# EAGLE design placa_v1 (EAGLE 7.2.0)
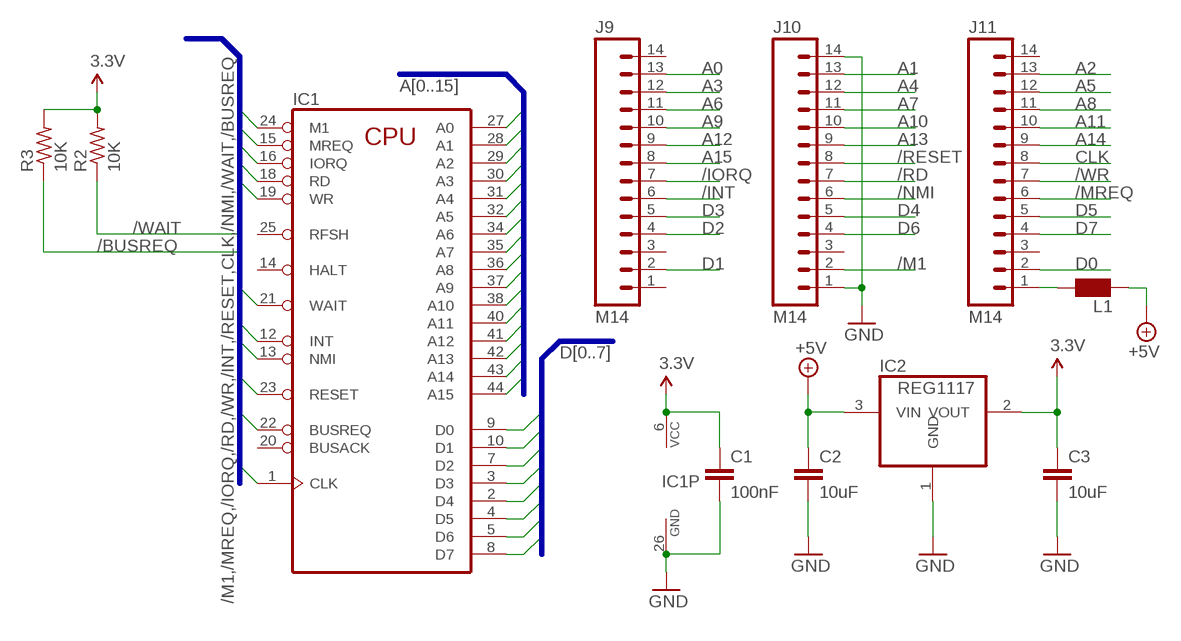
[diagram p0: schematic, sheet 1]

## Parts
C1  100nF  C-EUC0805K  [C0805K]
C2  10uF  C-EUC0805K  [C0805K]
C3  10uF  C-EUC0805K  [C0805K]
IC1  Z80CPU-F  [QFP-44]
IC2  REG1117  [SOT223]
J9  M14  [1X14]
J10  M14  [1X14]
J11  M14  [1X14]
L1  WE-CBF_0805  [0805]
R2  10K  R-US_R0805  [R0805]
R3  10K  R-US_R0805  [R0805]

## Nets
3.3V [power]: C1.1 C3.1 IC1.6(VCC) IC2.2(VOUT) R2.2 R3.2
+5V [power]: C2.1 IC2.3(VIN) L1.2
/BUSREQ: IC1.22(BUSREQ) R3.1
/INT: IC1.12(INT) J9.6
/IORQ: IC1.16(IORQ) J9.7
/M1: IC1.24(M1) J10.2
/MREQ: IC1.15(MREQ) J11.6
/NMI: IC1.13(NMI) J10.6
/RD: IC1.18(RD) J10.7
/RESET: IC1.23(RESET) J10.8
/WAIT: IC1.21(WAIT) R2.1
/WR: IC1.19(WR) J11.7
A0: IC1.27(A0) J9.13
A1: IC1.28(A1) J10.13
A2: IC1.29(A2) J11.13
A3: IC1.30(A3) J9.12
A4: IC1.31(A4) J10.12
A5: IC1.32(A5) J11.12
A6: IC1.34(A6) J9.11
A7: IC1.35(A7) J10.11
A8: IC1.36(A8) J11.11
A9: IC1.37(A9) J9.10
A10: IC1.38(A10) J10.10
A11: IC1.40(A11) J11.10
A12: IC1.41(A12) J9.9
A13: IC1.42(A13) J10.9
A14: IC1.43(A14) J11.9
A15: IC1.44(A15) J9.8
CLK: IC1.1(CLK) J11.8
D0: IC1.9(D0) J11.2
D1: IC1.10(D1) J9.2
D2: IC1.7(D2) J9.4
D3: IC1.3(D3) J9.5
D4: IC1.2(D4) J10.5
D5: IC1.4(D5) J11.5
D6: IC1.5(D6) J10.4
D7: IC1.8(D7) J11.4
GND [power]: C1.2 C2.2 C3.2 IC1.26(GND) IC2.1(GND) J10.1 J10.14
N$1 [power]: J11.1 L1.1
Unconnected: IC1.11(NC) IC1.14(HALT) IC1.17(NC) IC1.20(BUSACK) IC1.25(RFSH) IC1.33(NC) IC1.39(NC) J9.1 J9.3 J9.14 J10.3 J11.3 J11.14

## Buses
A[0..15]
D[0..7]
/M1,/MREQ,/IORQ,/RD,/WR,/INT,/RESET,CLK,/NMI,/WAIT,/BUSREQ

## Library data of the parts
C1-C3 = rcl:C-EU: CAPACITOR, European symbol
IC1 = Z80FAMIL:Z80CPU-F
IC2 = burr-brown:REG1117: 800mA and 1A Low Dropout (LDO) Positive Regulator 1.8V, 2.5V, 2.85V, 3.3V, 5V, and Adj
J9-J11 = SparkFun:M14: Header 14 Standard 14-pin 0.1" header. Use with straight break away headers (SKU : PRT-00116), right angle break away headers (PRT-00553), swiss pins (PRT-00743), machine pins (PRT-00117), and female headers (PRT-00115).
L1 = wuerth-elektronik:WE-CBF: SMD EMI Suppression Ferrite Beads - excellent anti-EMI properties - low DCR - impedances till 3000 ohms - rated current up to 6 A
R2 R3 = rcl:R-US_: RESISTOR, American symbol

## Net classes
0 default: width 0.203 mm, clearance 0.203 mm
1 power: width 0.406 mm, clearance 0.203 mm to class 0, clearance 0.203 mm

## Board
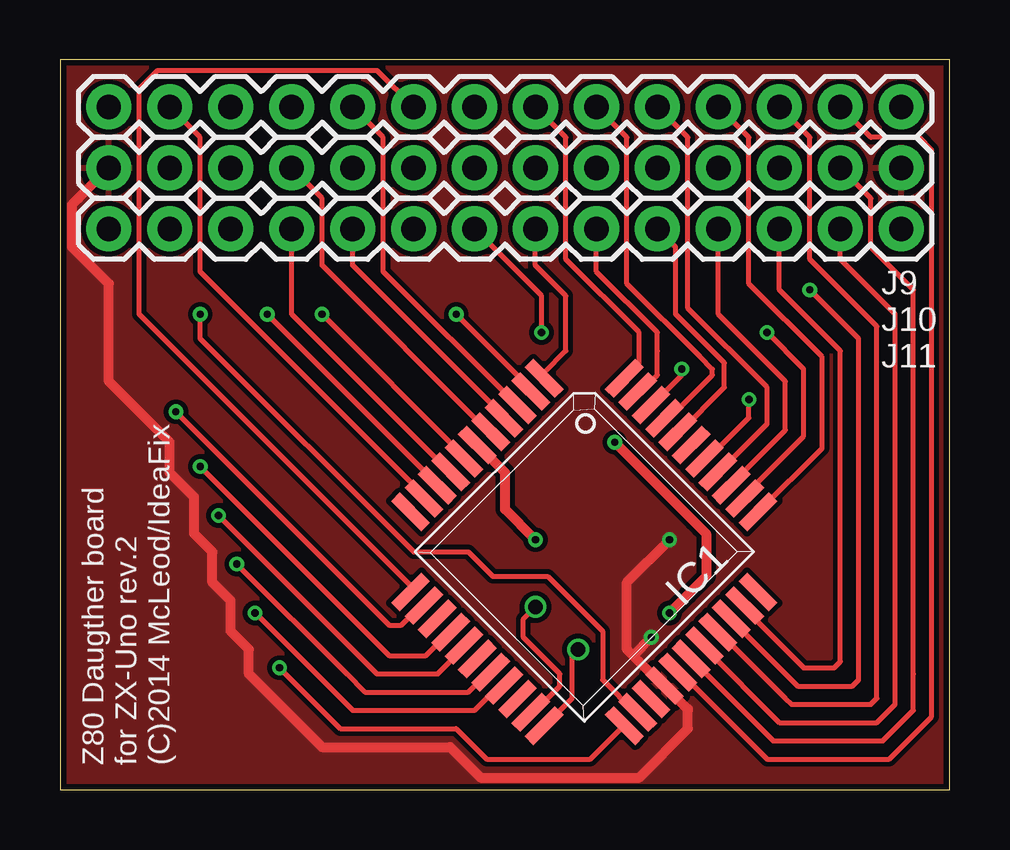
[diagram p1: board, top side]
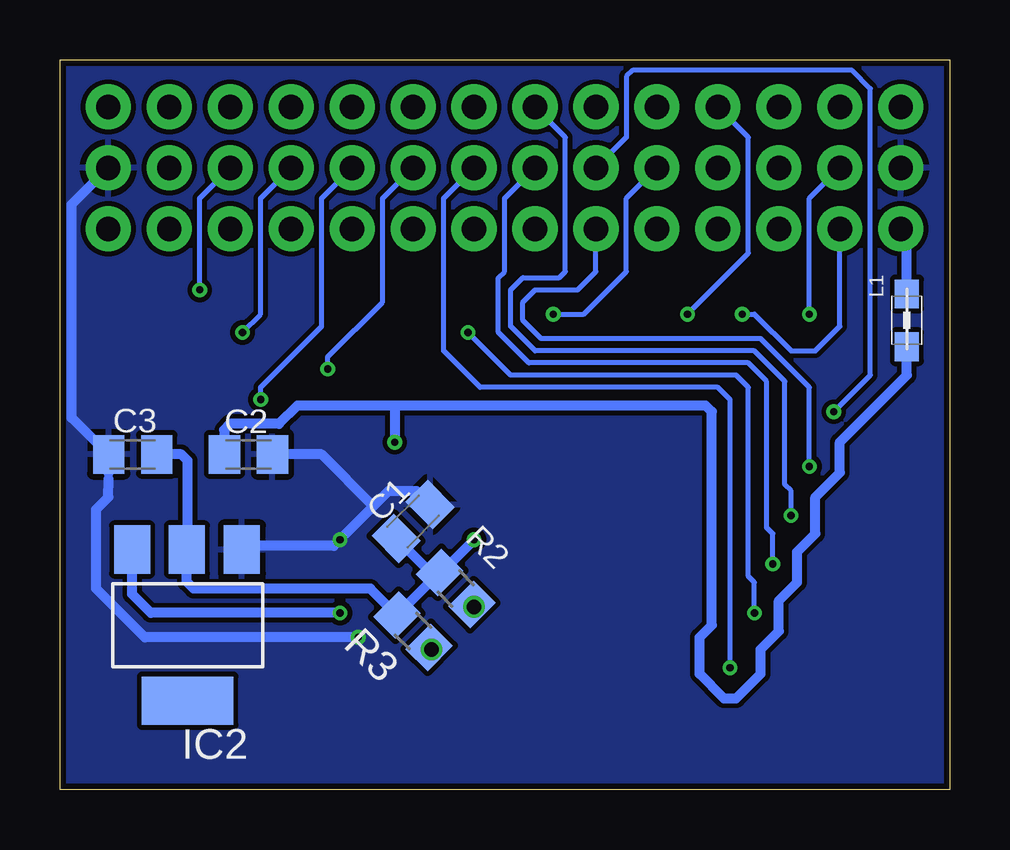
[diagram p2: board, bottom side, seen from below]

Size 37.06 x 30.4 mm. Coordinates in mm from the lower left corner, seen from the top.
Outline: 0,0 37.06,0 37.06,30.4 0,30.4 0,0
Copper layers (1*16): Top 0.035mm / dielectric 1.5mm / Bottom 0.035mm
Design rules "ITEADstudio_DRC": minimum track width 6mil, minimum drill 12mil, track to track 6mil, track to pad 6mil, pad to pad 6mil, via to via 6mil, smd to smd 0mil, copper to edge 10mil, drill to drill 10mil, minimum pad ring 10mil, minimum via ring 6mil, stop-mask expansion 2mil, vias tented up to drill 100mil, thermal gap 10mil

### Footprints (pad centres in the part's own frame; a part is rotated, then mirrored left to right if it is on the bottom)
C0805K = smd 1.3 x 1.6: 1 -1,0; 2 1,0
QFP-44 = smd 0.508 x 1.778: 1 -3.937,-6.299; 2 -3.15,-6.299; 3 -2.362,-6.299; 4 -1.575,-6.299; 5 -0.787,-6.299; 6 0,-6.299; 7 0.787,-6.299; 8 1.575,-6.299; 9 2.362,-6.299; 10 3.15,-6.299; 11 3.937,-6.299; 23 3.937,6.299; 24 3.15,6.299; 25 2.362,6.299; 26 1.575,6.299; 27 0.787,6.299; 28 0,6.299; 29 -0.787,6.299; 30 -1.575,6.299; 31 -2.362,6.299; 32 -3.15,6.299; 33 -3.937,6.299 | smd 1.778 x 0.508: 12 6.299,-3.937; 13 6.299,-3.15; 14 6.299,-2.362; 15 6.299,-1.575; 16 6.299,-0.787; 17 6.299,0; 18 6.299,0.787; 19 6.299,1.575; 20 6.299,2.362; 21 6.299,3.15; 22 6.299,3.937; 34 -6.299,3.937; 35 -6.299,3.15; 36 -6.299,2.362; 37 -6.299,1.575; 38 -6.299,0.787; 39 -6.299,0; 40 -6.299,-0.787; 41 -6.299,-1.575; 42 -6.299,-2.362; 43 -6.299,-3.15; 44 -6.299,-3.937
SOT223 = smd 1.499 x 2.007: 1 -2.261,-3.15; 2 0.025,-3.15; 3 2.311,-3.15 | smd 3.81 x 2.007: 4 0,3.15
1X14 = drill 1.016 pad 1.88: 1 0,0; 2 2.54,0; 3 5.08,0; 4 7.62,0; 5 10.16,0; 6 12.7,0; 7 15.24,0; 8 17.78,0; 9 20.32,0; 10 22.86,0; 11 25.4,0; 12 27.94,0; 13 30.48,0; 14 33.02,0
0805 = smd 1.2 x 1: 1 -1.1,0; 2 1.1,0
R0805 = smd 1.3 x 1.5: 1 -0.95,0; 2 0.95,0

### Placement (x,y rotation side)
C1  22.35,11.18 45 bottom
C2  29.21,13.97 0 bottom
C3  34.04,13.97 180 bottom
IC1  21.84,9.91 225 top
IC2  31.75,6.86 180 bottom
J9  2.03,28.45 0 top
J10  2.03,25.91 0 top
J11  2.03,23.37 0 top
L1  1.78,19.56 270 bottom
R2  20.57,8.38 135 bottom
R3  22.35,6.6 135 bottom

### Tracks (layer width: path | path; a pad name or v marks a point on that pad's centre or on a via)
3.3V  (via drill 0.3)
  Top 0.406: IC1.6 18.54,13.21 18.54,11.68 v19.81,10.41
  Bottom 0.203: 21.64,9.05 R2.2 20.9,9.4 20.83,9.4 | IC2.2 31.75,10.03
  Bottom 0.406: 21.64,9.05 C1.1 | R2.2 R3.2 24.13,8.38 31.5,8.38 31.77,8.66 IC2.2 | 20.83,9.4 v19.81,10.41 | C3.1 32,13.97 31.75,13.72 31.75,10.03
+5V  (via drill 0.3)
  Top 0.406: v25.4,7.37 26.16,8.13 26.92,8.89 26.92,10.67 26.67,10.92 26.42,11.18 v23.11,14.48
  Bottom 0.203: 30.23,13.99 C2.1
  Bottom 0.406: L1.2 1.78,17.27 4.57,14.48 4.57,13.21 5.59,12.19 5.59,10.67 6.35,9.91 6.35,8.64 7.11,7.87 7.11,6.6 7.87,5.84 7.87,4.83 8.89,3.81 9.4,3.81 10.41,4.83 10.41,6.35 9.91,6.86 9.91,15.75 10.16,16 21.59,16 23.11,16 | 23.11,16 27.18,16 27.94,15.24 29.97,15.24 30.23,14.99 30.23,13.99 | IC2.3 34.06,8.15 33.27,7.37 v25.4,7.37 | v23.11,14.48 23.11,15.49 23.11,16
/BUSREQ  (via drill 0.6)
  Top 0.203: IC1.22 20.19,2.67 21.34,3.81 21.34,5.59 v21.59,5.84
  Bottom 0.203: v21.59,5.84 21.34,5.59 R3.1
/INT
  Top 0.203: IC1.12 14.61,8.51 3.3,19.81 3.3,29.21 4.06,29.97 13.21,29.97 J9.6
/IORQ  (via drill 0.3)
  Top 0.203: IC1.16 16.83,5.91 15.75,4.83 13.21,4.83 v6.6,11.43
  Bottom 0.203: v6.6,11.43 6.6,12.45 6.86,12.7 6.86,17.02 8.13,18.29 17.27,18.29 18.29,19.3 18.29,20.83 18.03,21.08 17.78,21.34 16.26,21.34 16,21.59 16,27.18 J9.7
/M1  (via drill 0.3 pad 0.61)
  Top 0.203: IC1.24 23.95,3.23 22.61,4.57 22.61,6.6 20.32,8.89 18.03,8.89 17.02,9.91 14.73,9.91 5.84,18.8 v5.84,19.81
  Bottom 0.203: v5.84,19.81 5.84,24.64 J10.2
/MREQ  (via drill 0.3)
  Top 0.203: IC1.15 16.22,6.57 15.24,5.59 13.72,5.59 v5.84,13.46
  Bottom 0.203: v5.84,13.46 5.84,16.76 7.87,18.8 17.02,18.8 17.78,19.56 17.78,20.32 17.27,20.83 15.49,20.83 14.73,21.59 J11.6
/NMI  (via drill 0.3 pad 0.61)
  Top 0.203: IC1.13 15.04,7.68 14.22,6.86 13.72,6.86 12.95,7.62 v4.83,15.75
  Bottom 0.203: v4.83,15.75 3.3,17.27 3.3,29.21 4.06,29.97 13.21,29.97 13.46,29.72 13.46,27.18 J10.6
/RD  (via drill 0.3)
  Top 0.203: IC1.18 17.85,4.89 17.02,4.06 12.7,4.06 11.94,4.83 v7.37,9.4
  Bottom 0.203: v7.37,9.4 7.37,10.67 7.62,10.92 7.62,17.02 8.38,17.78 17.53,17.78 18.8,19.05 18.8,21.34 18.54,21.59 18.54,24.64 J10.7
/RESET  (via drill 0.3)
  Top 0.203: IC1.23 23.5,2.67 22.1,1.27 17.78,1.27 16.51,2.54 11.68,2.54 v9.14,5.08
  Bottom 0.203: v9.14,5.08 9.14,16.26 9.65,16.76 19.56,16.76 21.08,18.29 21.08,24.64 J10.8
/WAIT  (via drill 0.6)
  Top 0.203: IC1.21 19.73,3.23 20.83,4.32 20.83,4.83 19.3,6.35 19.3,7.11 v19.81,7.62
  Bottom 0.203: v19.81,7.62 19.56,7.37 R2.1
/WR  (via drill 0.3)
  Top 0.203: IC1.19 18.31,4.34 17.53,3.56 17.27,3.3 12.19,3.3 v8.13,7.37 | v20.07,19.05 20.07,20.57 J11.7
  Bottom 0.203: v8.13,7.37 8.13,8.64 8.38,8.89 8.38,16.76 8.89,17.27 18.29,17.27 v20.07,19.05
A0
  Top 0.203: IC1.27 25.84,4.89 29.46,1.27 34.54,1.27 36.32,3.05 36.32,26.67 35.81,27.18 33.78,27.18 J9.13
A1
  Top 0.203: IC1.28 29.72,2.03 34.29,2.03 35.56,3.3 35.56,4.83 35.56,20.83 33.78,22.61 33.78,24.64 J10.13
A2
  Top 0.203: IC1.29 26.86,5.91 29.97,2.79 34.04,2.79 34.8,3.56 34.8,19.81 32.51,22.1 J11.13
A3
  Top 0.203: IC1.30 27.47,6.57 30.23,3.81 30.48,3.56 33.78,3.56 34.04,3.81 34.04,19.3 31.24,22.1 31.24,27.18 J9.12
A4  (via drill 0.3)
  Top 0.203: IC1.31 27.97,7.08 30.73,4.32 33.02,4.32 33.27,4.57 33.27,18.8 v31.24,20.83
  Bottom 0.203: v31.24,20.83 31.24,24.64 J10.12
A5
  Top 0.203: IC1.32 28.52,7.54 30.99,5.08 32.26,5.08 32.51,5.33 32.51,18.29 29.97,20.83 J11.12
A6
  Top 0.203: IC1.34 29.1,11.58 31.75,14.22 31.75,18.03 28.7,21.08 28.7,27.18 J9.11
A7  (via drill 0.3)
  Top 0.203: IC1.35 28.52,12.27 30.99,14.73 30.99,17.53 v29.46,19.05
  Bottom 0.203: v29.46,19.05 28.7,19.81 28.7,24.64 J10.11
A8
  Top 0.203: IC1.36 27.97,12.73 30.23,14.99 30.23,17.02 27.43,19.81 J11.11
A9
  Top 0.203: IC1.37 27.47,13.25 29.46,15.24 29.46,16.76 26.16,20.07 26.16,27.18 J9.10
A10  (via drill 0.3)
  Top 0.203: IC1.38 27.01,13.8 28.7,15.49 v28.7,16.26
  Bottom 0.203: J10.10 26.16,24.64 26.16,19.3 26.92,18.54 28.7,16.76 v28.7,16.26
A11
  Top 0.203: IC1.40 25.84,14.92 27.69,16.76 27.69,17.78 25.65,19.81 25.65,22.61 J11.10
A12
  Top 0.203: IC1.41 25.38,15.47 27.18,17.27 27.18,17.53 26.67,18.03 23.62,21.08 23.62,27.18 J9.9
A13  (via drill 0.3)
  Top 0.203: IC1.42 24.67,16.03 25.91,17.27 v25.91,17.53
  Bottom 0.203: v25.91,17.53 25.91,18.03 23.62,20.32 23.62,24.64 J10.9
A14
  Top 0.203: IC1.43 24.21,16.59 24.89,17.27 24.89,18.29 24.89,19.05 22.35,21.59 J11.9
A15
  Top 0.203: IC1.44 23.51,17.16 24.13,17.78 24.13,18.8 24.13,19.05 21.08,22.1 21.08,27.18 J9.8
CLK
  Top 0.203: IC1.1 20.17,17.38 21.08,18.29 21.08,20.57 19.81,21.84 J11.8
D0  (via drill 0.3 pad 0.61)
  Top 0.203: IC1.9 15.72,12.73 v8.64,19.81
  Bottom 0.203: v8.64,19.81 8.13,19.81 6.6,18.29 5.59,18.29 4.57,19.3 J11.2
D1
  Top 0.203: IC1.10 15.16,12.27 5.84,21.59 5.84,27.18 J9.2
D2  (via drill 0.3)
  Top 0.203: IC1.7 16.83,13.9 v10.92,19.81
  Bottom 0.203: v10.92,19.81 8.38,22.35 8.38,27.18 J9.4
D3
  Top 0.203: IC1.3 19.02,16.03 13.46,21.59 13.46,27.18 J9.5
D4  (via drill 0.3)
  Top 0.203: IC1.2 19.62,16.7 v16.51,19.81
  Bottom 0.203: v16.51,19.81 15.24,19.81 13.46,21.59 13.46,24.64 J10.5
D5
  Top 0.203: IC1.4 18.5,15.53 12.19,21.84 J11.5
D6
  Top 0.203: IC1.5 17.85,14.92 10.92,21.84 10.92,24.64 J10.4
D7
  Top 0.203: IC1.8 16.22,13.25 9.65,19.81 J11.4
GND  (via drill 0.3)
  Top 0.203: IC1.26 25.13,4.34 | 26.16,3.3 26.16,3.36
  Top 0.406: 23.88,5.59 23.62,5.84 23.62,8.64 v25.4,10.41 | 25.13,4.34 23.88,5.59 | 23.88,5.59 v24.64,6.35 | J10.1 0.76,24.64 0.51,24.38 0.51,22.61 2.03,21.08 2.03,17.02 4.57,14.48 4.57,13.21 5.59,12.19 5.59,10.67 6.35,9.91 6.35,8.64 7.11,7.87 7.11,6.6 7.87,5.84 7.87,4.83 10.92,1.78 16.26,1.78 17.53,0.51 24.13,0.51 26.16,2.54 26.16,3.3 | 26.16,3.36 IC1.26
  Bottom 0.203: 24.13,11.68 24,11.81 | 22.21,12.45 C1.2 | C3.2 35.05,13.97 | 35.04,12.94 35.04,13.19 | 29.34,10.16 IC2.1
  Bottom 0.406: J10.14 36.58,24.38 36.58,18.03 36.58,15.49 35.05,13.97 | 35.04,13.19 C3.2 | 22.21,12.45 23.37,12.45 24,11.81 26.16,13.97 C2.2 | 35.04,12.94 35.05,12.19 35.56,11.68 35.56,8.38 34.54,7.37 33.53,6.35 v24.64,6.35 | 24.13,11.68 v25.4,10.41 25.65,10.16 29.34,10.16
  pour Top (isolate 0.203): 0,30.48 37.08,30.48 37.08,0 0,0
  pour Bottom (isolate 0.203): 0,30.48 37.08,30.48 37.08,0 0,0
N$1
  Bottom 0.203: 1.78,23.11 J11.1
  Bottom 0.406: L1.1 1.78,23.11

### Text on the board
tNames: Z80 Daugther board / for ZX-Uno rev.2 / (C)2014 McLeod/IdeaFix